# Altium schematic sheet pin-connection-points.SchDoc
size 101 x 76 mm
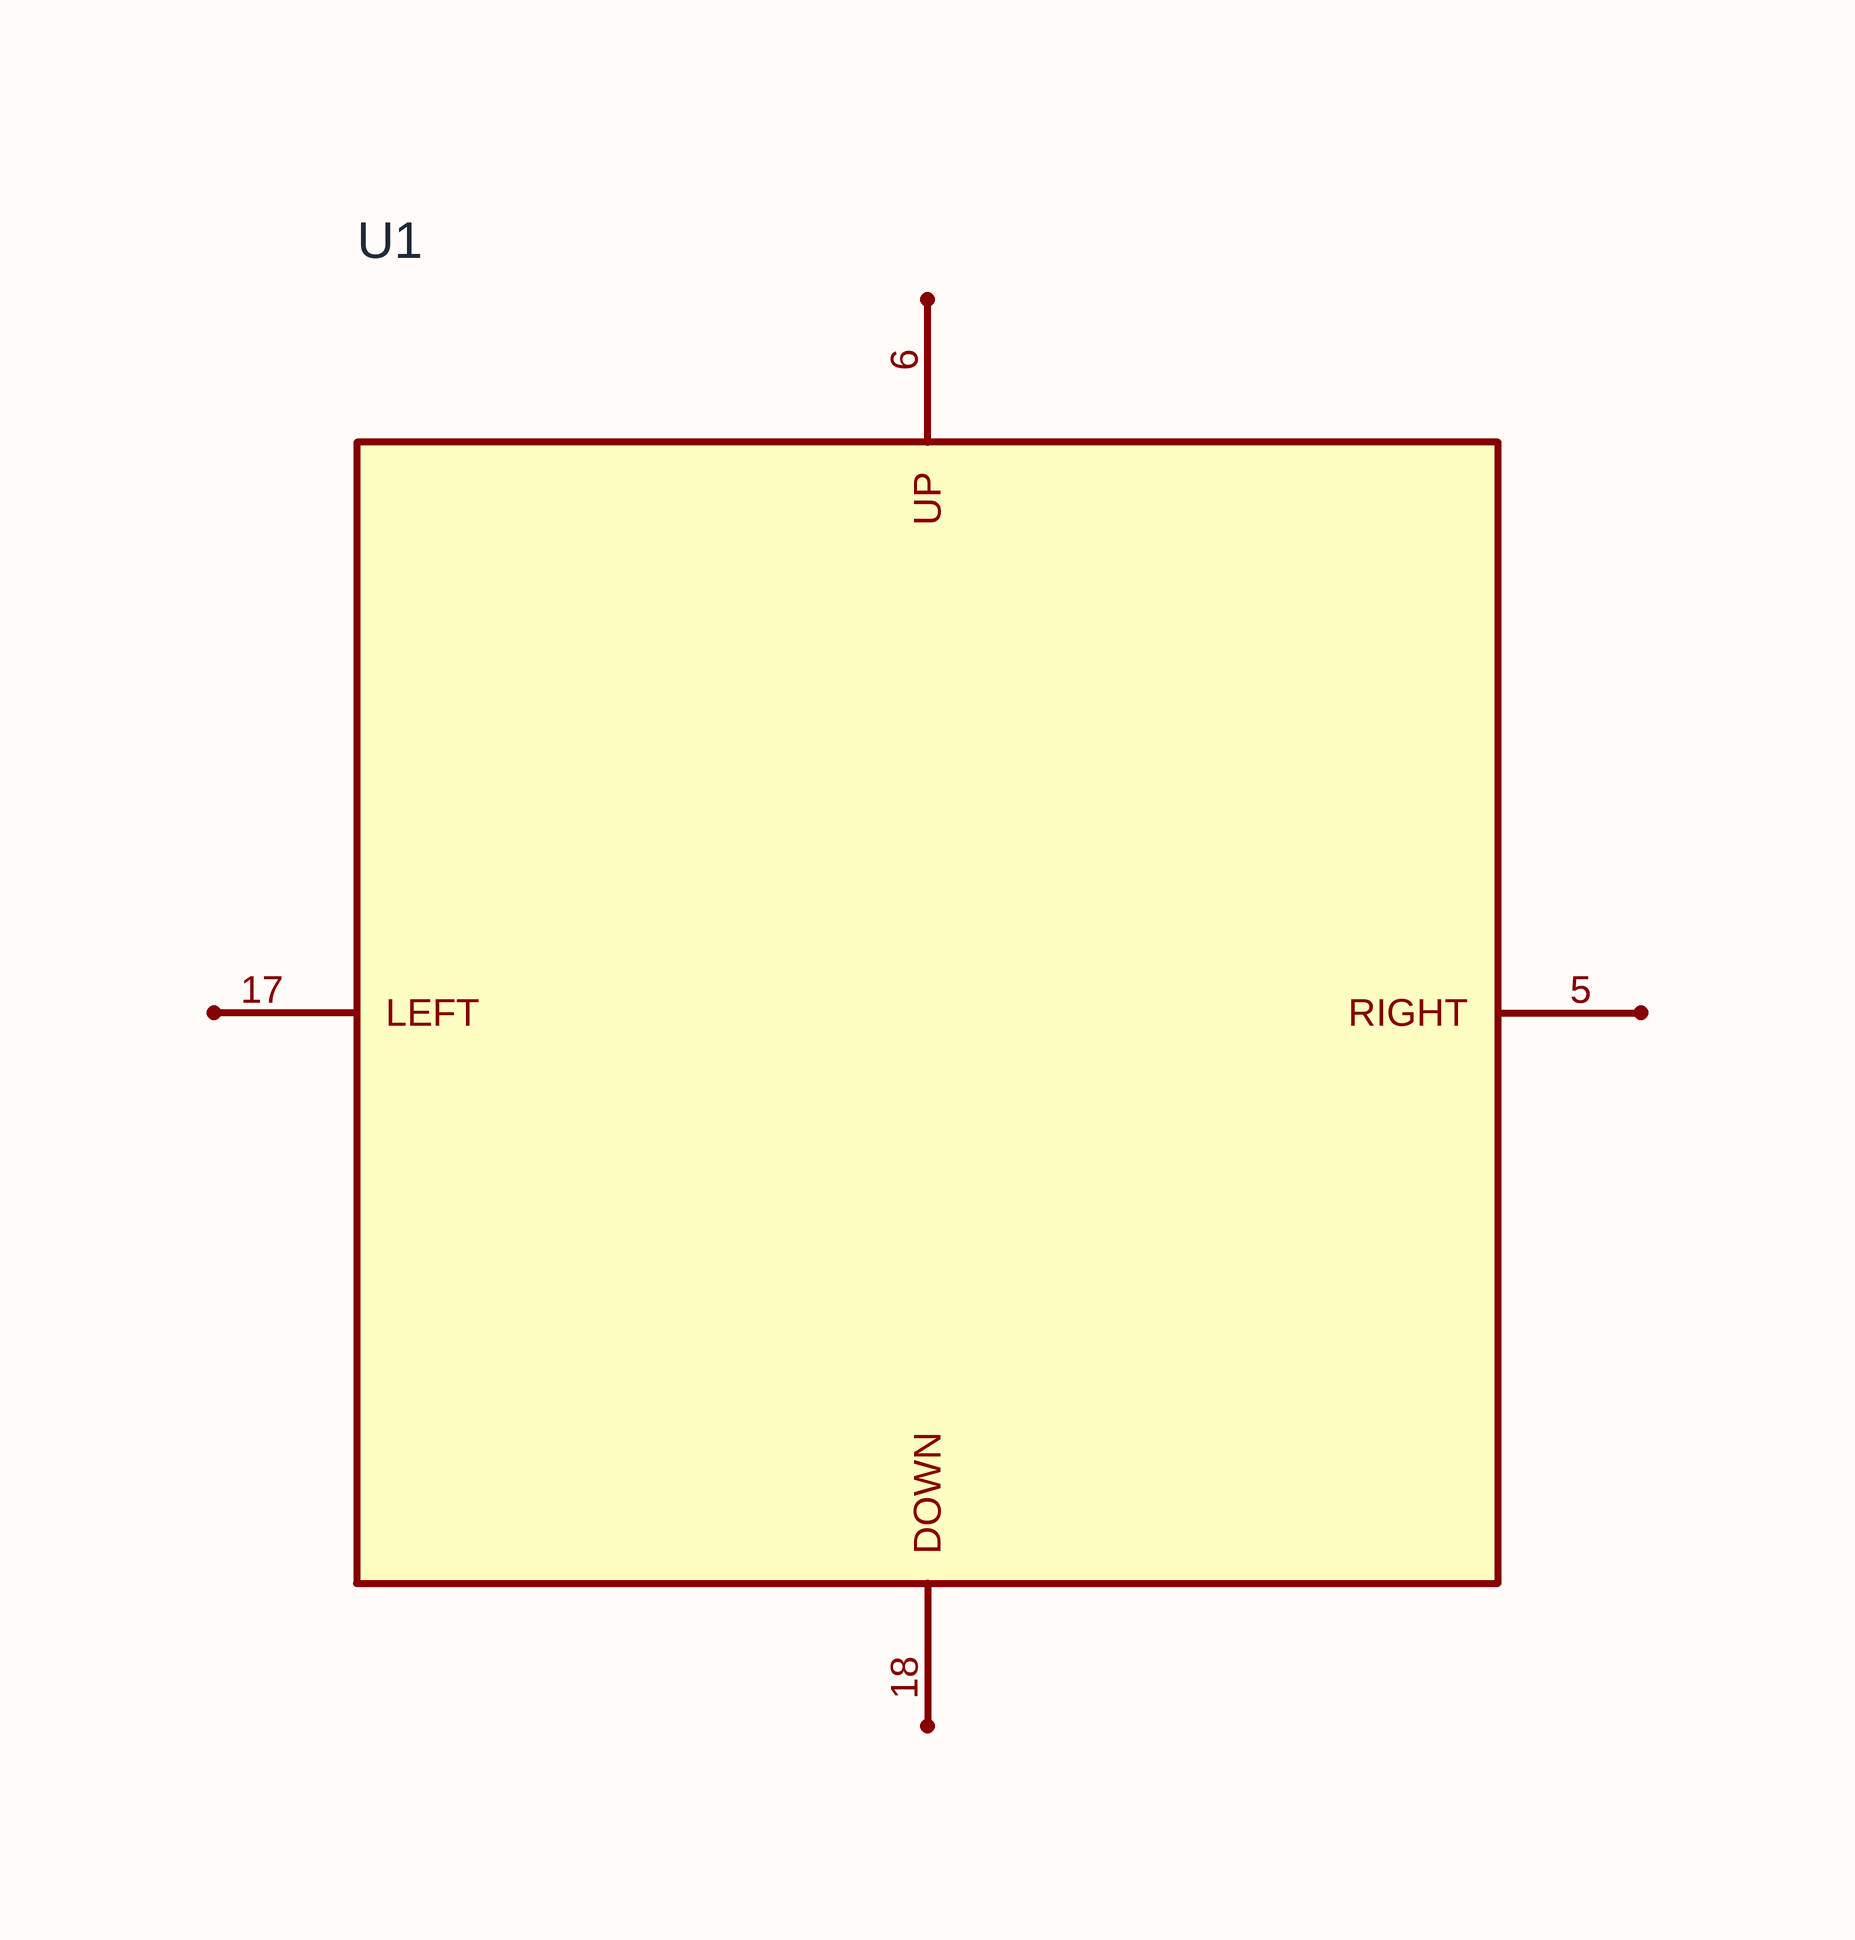
[diagram p0: pin-connection-points.SchDoc]

## Parts
U1  (no value)

## Nets

Not connected (* = marked no-connect by the designer): U1 5(RIGHT) 6(UP) 17(LEFT) 18(DOWN)

## Library data of the parts
U1 = U1